# Altium schematic sheet Regulators3.SchDoc
size Tabloid
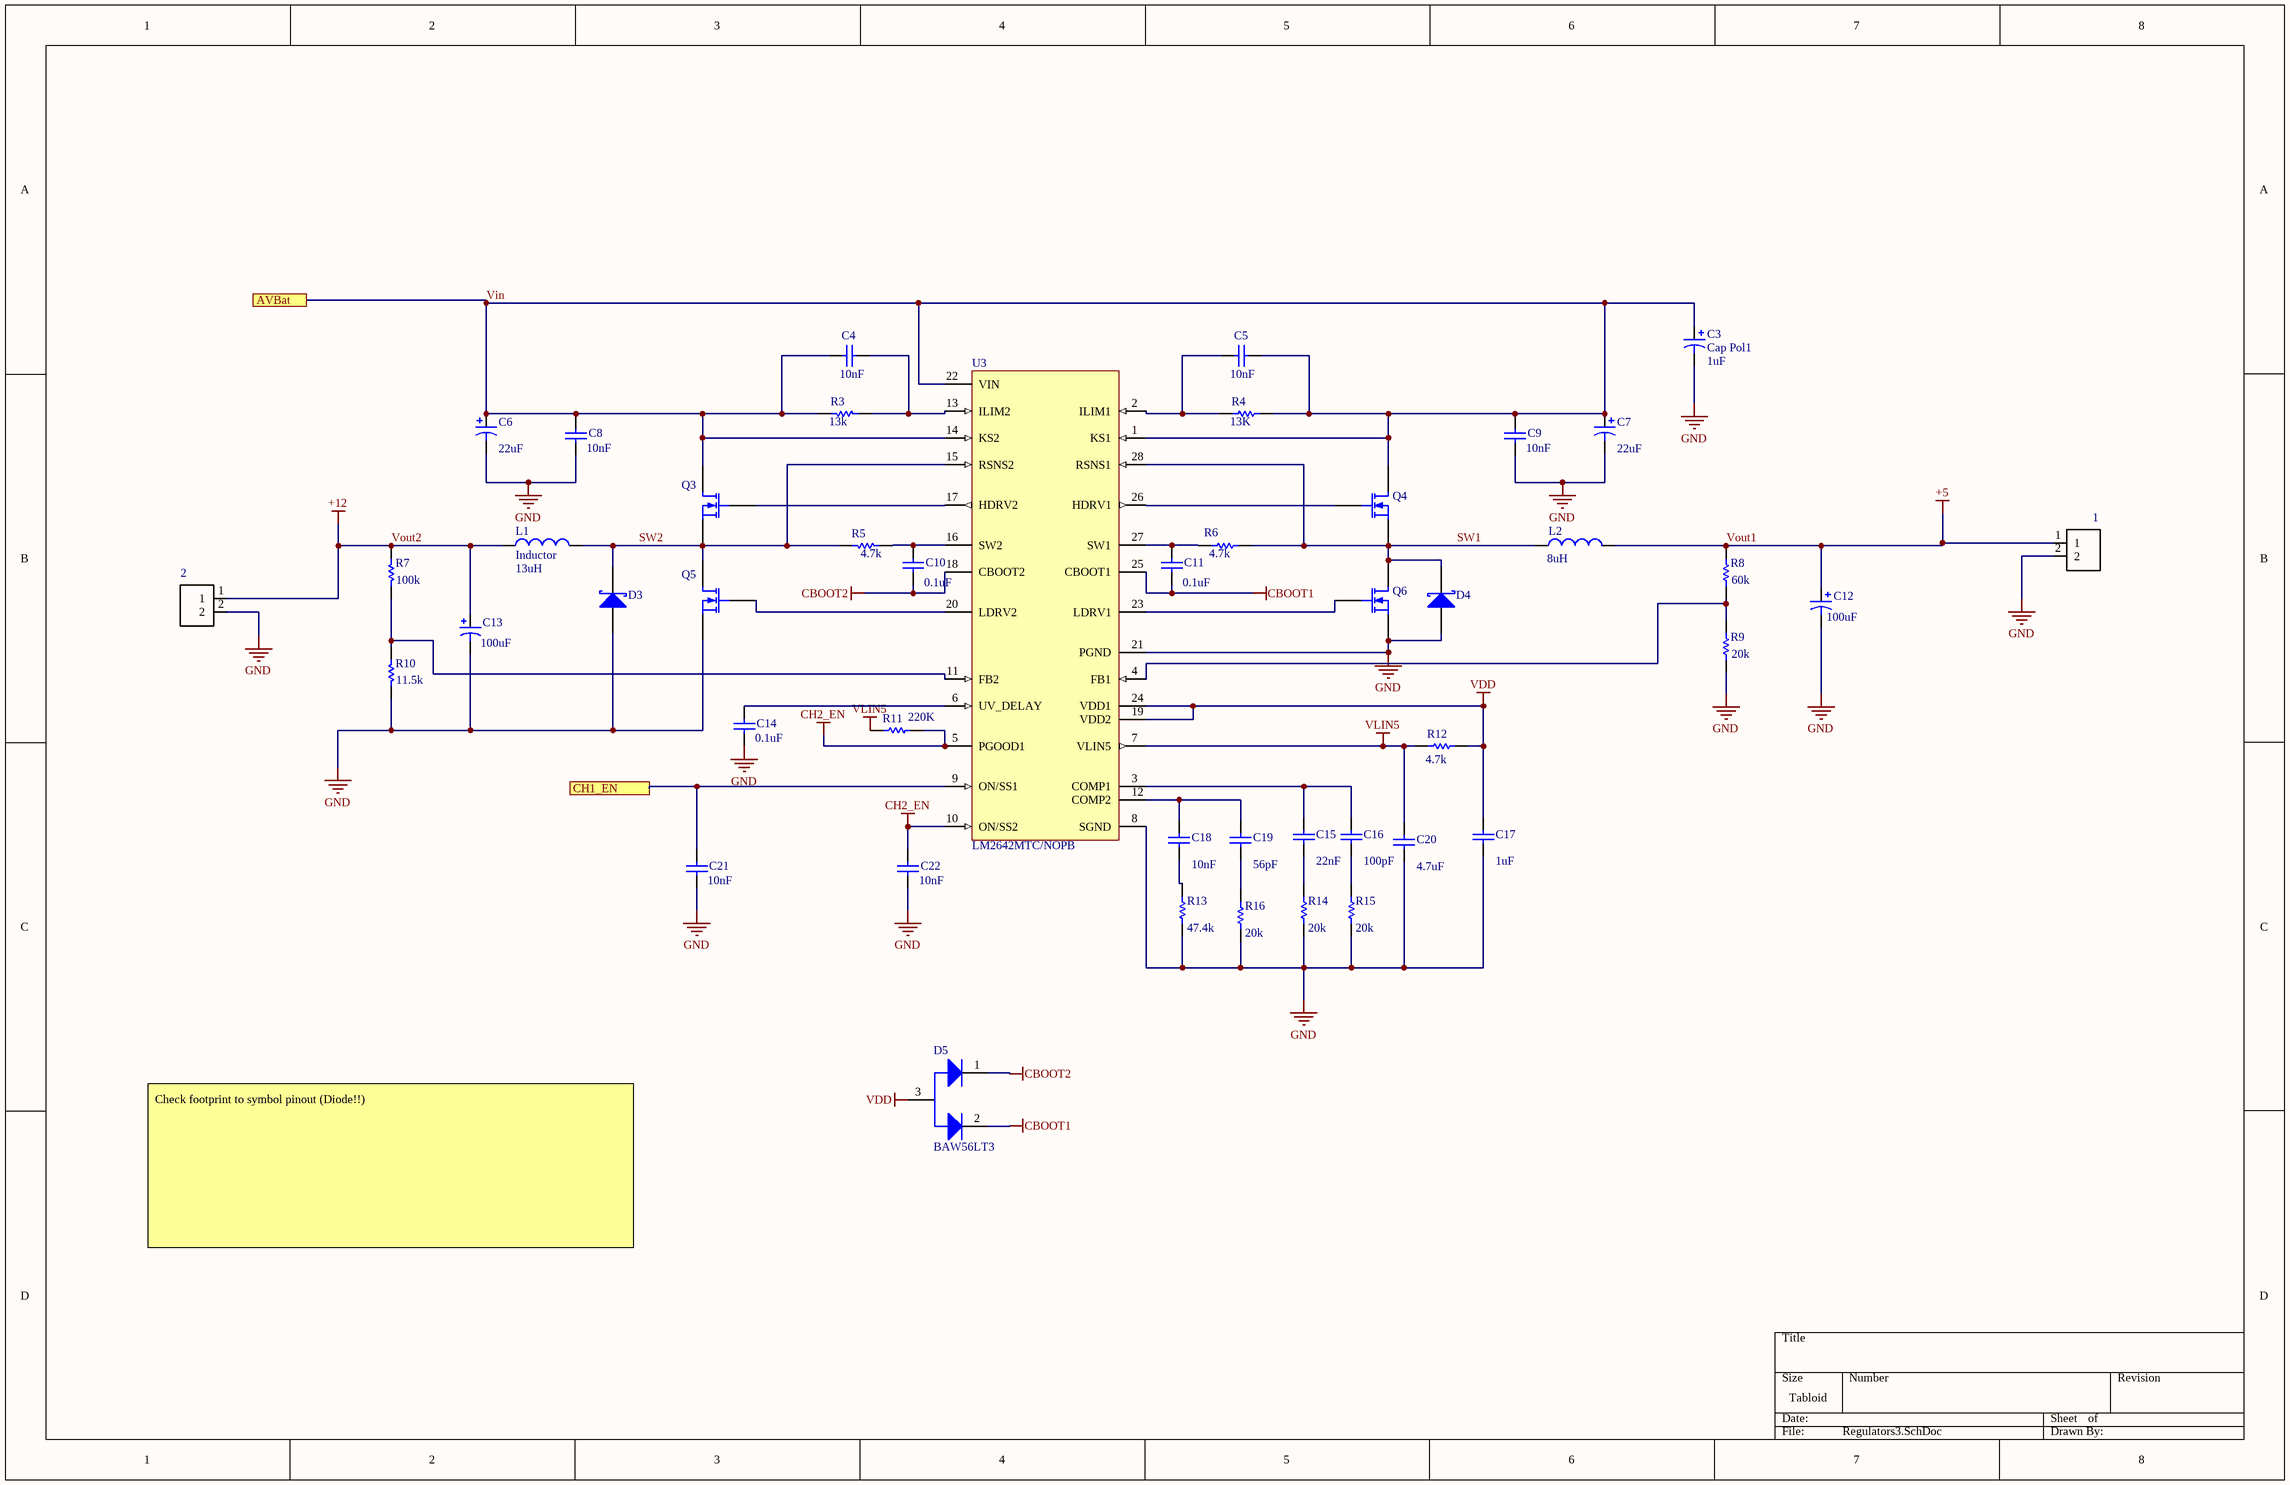
[diagram p0: Regulators3.SchDoc]

## Parts
1  282836-2  [*CONN_282836-2]  (value not drawn)
2  282836-2  [*CONN_282836-2]  (value not drawn)
C3  Cap Pol1  value 1uF  [1u50VcapE]
C4  value 10nF  [1608[0603]]  (hidden comment: Cap)
C5  value 10nF  [1608[0603]]  (hidden comment: Cap)
C6  value 22uF  [22u16VcapE]  (hidden comment: Cap Pol1)
C7  value 22uF  [22u16VcapE]  (hidden comment: Cap Pol1)
C8  value 10nF  [1608[0603]]  (hidden comment: Cap)
C9  value 10nF  [1608[0603]]  (hidden comment: Cap)
C10  value 0.1uF  [1608[0603]]  (hidden comment: Cap)
C11  value 0.1uF  [1608[0603]]  (hidden comment: Cap)
C12  value 100uF  [*CAPAE660X800N]  (hidden comment: Cap Pol1)
C13  value 100uF  [*CAPAE660X800N]  (hidden comment: Cap Pol1)
C14  value 0.1uF  [1608[0603]]  (hidden comment: Cap)
C15  value 22nF  [1608[0603]]  (hidden comment: Cap)
C16  value 100pF  [1608[0603]]  (hidden comment: Cap)
C17  value 1uF  [1608[0603]]  (hidden comment: Cap)
C18  value 10nF  [1608[0603]]  (hidden comment: Cap)
C19  value 56pF  [1608[0603]]  (hidden comment: Cap)
C20  value 4.7uF  [1608[0603]]  (hidden comment: Cap)
C21  value 10nF  [1608[0603]]  (hidden comment: Cap)
C22  value 10nF  [1608[0603]]  (hidden comment: Cap)
D3  Diode MBRS140t3  [*DIOM5227X270N_S1M(Primary)]  (value not drawn)
D4  Diode MBRS140t3  [*DIOM5227X270N_S1M(Primary)]  (value not drawn)
D5  BAW56LT3  [ONSC-SOT-23-3-318-08_V]
L1  Inductor  value 13uH  [Inductor]
L2  value 8uH  [Inductor]  (hidden comment: Inductor)
Q3  MOSFET-N  [SO8_L]  (value not drawn)
Q4  MOSFET-N  [SO8_L]  (value not drawn)
Q5  MOSFET-N  [SO8_L]  (value not drawn)
Q6  MOSFET-N  [SO8_L]  (value not drawn)
R3  value 13k  [1608[0603]]  (hidden comment: Res1)
R4  value 13K  [1608[0603]]  (hidden comment: Res1)
R5  value 4.7k  [1608[0603]]  (hidden comment: Res1)
R6  value 4.7k  [1608[0603]]  (hidden comment: Res1)
R7  value 100k  [1608[0603]]  (hidden comment: Res1)
R8  value 60k  [1608[0603]]  (hidden comment: Res1)
R9  value 20k  [1608[0603]]  (hidden comment: Res1)
R10  value 11.5k  [1608[0603]]  (hidden comment: Res1)
R11  value 220K  [1608[0603]]  (hidden comment: Res1)
R12  value 4.7k  [1608[0603]]  (hidden comment: Res1)
R13  value 47.4k  [1608[0603]]  (hidden comment: Res1)
R14  value 20k  [1608[0603]]  (hidden comment: Res1)
R15  value 20k  [1608[0603]]  (hidden comment: Res1)
R16  value 20k  [1608[0603]]  (hidden comment: Res1)
U3  LM2642MTC/NOPB  [MTC28_N]

## Ports
AVBat, CH1_EN

## Nets
CBOOT1: C11.1 D5.2(K2) U3.25(CBOOT1)
CBOOT2: C10.1 D5.1(K1) U3.18(CBOOT2)
CH2_EN: C22.2 R11.2 U3.5(PGOOD1) U3.10(ON/SS2)
GND: 1.2 2.2 C3.2 C6.2 C7.2 C8.1 C9.1 C12.2 C13.2 C14.1 C17.1 C20.1 C21.1 C22.1 D3.3(A) D4.3(A) Q5.3(S) Q6.3(S) R9.1 R10.1 R13.1 R14.1 R15.1 R16.1 U3.8(SGND) U3.21(PGND)
VDD: C17.2 D5.3(A) R12.2 U3.19(VDD2) U3.24(VDD1)
VLIN5: C20.2 R11.1 R12.1 U3.7(VLIN5)
Vout1: 1.1 C12.1 L2.2 R8.2  [also labelled +5]
Vout2: 2.1 C13.1 L1.1 R7.2  [also labelled +12]
CH1_EN: C21.2 U3.9(ON/SS1) ; port CH1_EN
SW1: D4.1(K) L2.1 Q4.3(S) Q6.1(D) R6.2 U3.28(RSNS1)
SW2: D3.1(K) L1.2 Q3.3(S) Q5.1(D) R5.2 U3.15(RSNS2)
Vin: C3.1 C4.2 C5.2 C6.1 C7.1 C8.2 C9.2 Q3.1(D) Q4.1(D) R3.2 R4.2 U3.1(KS1) U3.14(KS2) U3.22(VIN) ; port AVBat
NetC4_1: C4.1 R3.1 U3.13(ILIM2)
NetC5_1: C5.1 R4.1 U3.2(ILIM1)
NetC10_2: C10.2 R5.1 U3.16(SW2)
NetC11_2: C11.2 R6.1 U3.27(SW1)
NetC14_2: C14.2 U3.6(UV_DELAY)
NetC15_1: C15.1 R14.2
NetC15_2: C15.2 C16.2 U3.3(COMP1)
NetC16_1: C16.1 R15.2
NetC18_1: C18.1 R13.2
NetC18_2: C18.2 C19.2 U3.12(COMP2)
NetC19_1: C19.1 R16.2
NetQ3_2: Q3.2(G) U3.17(HDRV2)
NetQ4_2: Q4.2(G) U3.26(HDRV1)
NetQ5_2: Q5.2(G) U3.20(LDRV2)
NetQ6_2: Q6.2(G) U3.23(LDRV1)
NetR7_1: R7.1 R10.2 U3.11(FB2)
NetR8_1: R8.1 R9.2 U3.4(FB1)

## Notes on the sheet
- Check footprint to symbol pinout (Diode!!)

## Library data of the parts
1 2 = 282836-2: Connector, Terminal Block; Wire Receptacle; 2 Pos.; 16-30 AWG; 0.197 in. CL; Sid; Number_of_Positions: 2; Centerline_Pitch: 5 mm[.197 in]; MF: TE Connectivity; TE_purchase_URL: https://www.te.com/usa-en/product-282836-2.html?te_bu=Cor&te_type=disp&te_campaign=seda_glo_cor-seda-global-disp-prtnr-fy19-seda-model-bom-cta_sma-317_1&elqCampaignId=32493; Digi-Key_Purchase_URL: https://www.digikey.ca/product-detail/en/te-connectivity-amp-connectors/282836-2/A98076-ND/1826939?utm_source=snapeda&utm_medium=aggregator&utm_campaign=symbol; MP: 282836-2; Package: None; SnapEDA_Link: https://www.snapeda.com/parts/282836-2/TE%20Connectivity%20AMP%20Connectors/view-part/?ref=snap; EU_RoHS_Compliance: Compliant with Exemptions; Digi-Key_Part_Number: A98076-ND; Value: *
C3 C6 C7 C12 C13 = Cap Pol1: Polarized Capacitor (Radial); Published: 8-Jun-2000; LatestRevisionDate: 17-Jul-2002; LatestRevisionNote: Re-released for DXP Platform.; PackageReference: RB7.6-15; Publisher: Altium Limited; PackageDescription: Polarized Capacitor (Radial); 2 Leads
C4 C5 C8-C11 C14-C22 = Cap: Capacitor; Published: 8-Jun-2000; LatestRevisionDate: 17-Jul-2002; LatestRevisionNote: Re-released for DXP Platform.; PackageReference: RAD-0.3; Publisher: Altium Limited; PackageDescription: Radial Cap, Thru-Hole; 2 Leads; 0.3 in Pin Spacing
D3 D4 = Diode 18TQ045: Schottky Rectifier; pin to pad: 1>A 3>C; Note: Terminal 2 is the TAB and is electrically connected to the cathode; Published: 8-Jun-2000; LatestRevisionDate: 17-Jul-2002; LatestRevisionNote: Re-released for DXP Platform.; DatasheetVersion: Dec-1997; PackageVersion: Feb-1998; PackageReference: TO-220AC; Publisher: Altium Limited; PackageDescription: TO, Thru-Hole, Vertical, Heatsink Mounted; 3 In-Line Leads (1 Absent); Pitch 2.54 mm; ComponentLink1Description: Manufacturer Link; ComponentLink1URL: http://www.irf.com/; ComponentLink2Description: Datasheet; ComponentLink2URL: http://www.irf.com/product-info/datasheets/data/18tq.pdf
D5 = BAW56LT3: Dual Switching Diodes, Common Anode, 3-Pin SOT-23, Tape and Reel; Manufacturer: On Semiconductor; Note: 0; IF Max (A): 0.2; trr Max (ns): 6; DatasheetVersion: Rev. 8; PackageVersion: Rev. AP, 11/2009; PackageReference: SOT-23-3-318-08; PackageDescription: 3-Pin Small Outline Transistor, Body 2.92 x 1.3 mm, Pitch 0.95 mm; Configuration: Common Anode; Packing: Tape and Reel; RoHS: FALSE; Mounting Technology: Surface Mount; PartNumber: BAW56LT3; ComponentLink1Description: Manufacturer URL; ComponentLink1URL: http://www.onsemi.com/; ComponentLink2Description: Datasheet; ComponentLink2URL: http://www.onsemi.cn/pub_link/Collateral/BAW56LT1-D.PDF; ComponentLink3Description: Package Specification; ComponentLink3URL: http://www.onsemi.cn/pub_link/Collateral/318-08.PDF
L1 L2 = Inductor: pin to pad: 1>A1 2>A2; Code_IEC: 1005; Published: 8-Jun-2000; LatestRevisionDate: 29-May-2009; LatestRevisionNote: IPC-7351 Footprint Added.; PackageReference: 0402-A; Publisher: Altium Limited; PackageDescription: Chip Inductor; Code_JEITA: 0402
Q3-Q6 = MOSFET-N: N-Channel MOSFET; Published: 8-Jun-2000; LatestRevisionDate: 17-Jul-2002; LatestRevisionNote: Re-released for DXP Platform.; PackageVersion: 1995/1996; PackageReference: E3; Publisher: Altium Limited; PackageDescription: TO, Flat Index; 3 In-Line, Axial Leads; Body Dia. 4.6mm; Lead Dia. 0.5 mm (max)
R3-R16 = Res1: Resistor; Published: 8-Jun-2000; LatestRevisionDate: 17-Jul-2002; LatestRevisionNote: Re-released for DXP Platform.; PackageReference: AXIAL-0.3; Publisher: Altium Limited; PackageDescription: Axial Device, Thru-Hole; 2 Leads; 0.3 in Pin Spacing
U3 = LM2642MTC/NOPB: Two-Phase Synchronous Step-Down Switching Controller, 28-pin TSSOP, Pb-Free; Manufacturer: National Semiconductor; PackageTopMarking: NSUZXYTTE#*LM2642MTC; PowerWise: N; CompType: Switcher; High-Reliability: Y; DatasheetVersion: Feb-2006; PackageVersion: revD, Jan-2005; PackageReference: MTC28; PackageDescription: Molded TSSOP, Jedec, 9.7 x 4.4 x 0.9mm Body, 28 Lead, 0.65mm Pitch; PartNumber: LM2642MTC/NOPB; RoHS: Y; PinCount: 28; Code_JEDEC: MO-153-AE; ComponentLink1Description: Manufacturer URL; ComponentLink1URL: http://www.national.com/; ComponentLink2Description: LM2642 Datasheet; ComponentLink2URL: http://www.national.com/ds/LM/LM2642.pdf; ComponentLink3Description: LM2642 Web Page; ComponentLink3URL: http://www.national.com/pf/LM/LM2642.html; ComponentLink4Description: MTC28 Package Page; ComponentLink4URL: http://www.national.com/packaging/folders/mtc28.html